# Altium project Task Tyler.PrjPcb (part 3 of 3)

## Sheet SOUND_SEC.SchDoc
size A4; SheetNumber: 7; SheetTotal: 30
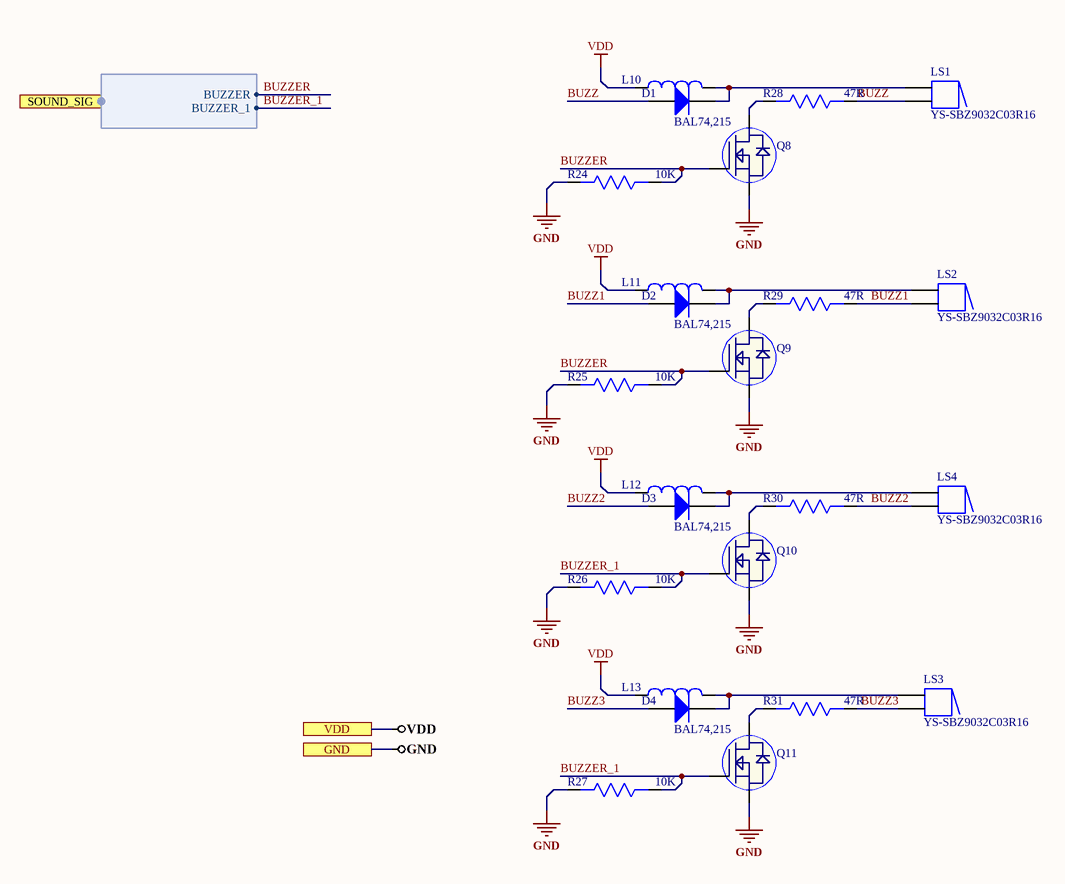
[diagram p29: SOUND_SEC.SchDoc]

### Parts
D1  BAL74,215  [SOT23-3]
D2  BAL74,215  [SOT23-3]
D3  BAL74,215  [SOT23-3]
D4  BAL74,215  [SOT23-3]
L10  MMZ0603S601CT000  [IND 0201]  (value not drawn)
L11  MMZ0603S601CT000  [IND 0201]  (value not drawn)
L12  MMZ0603S601CT000  [IND 0201]  (value not drawn)
L13  MMZ0603S601CT000  [IND 0201]  (value not drawn)
LS1  YS-SBZ9032C03R16  [YS-SBZ9032C03R16]
LS2  YS-SBZ9032C03R16  [YS-SBZ9032C03R16]
LS3  YS-SBZ9032C03R16  [YS-SBZ9032C03R16]
LS4  YS-SBZ9032C03R16  [YS-SBZ9032C03R16]
Q8  BSS138LT1G  [SOT23-3]  (value not drawn)
Q9  BSS138LT1G  [SOT23-3]  (value not drawn)
Q10  BSS138LT1G  [SOT23-3]  (value not drawn)
Q11  BSS138LT1G  [SOT23-3]  (value not drawn)
R24  10K  [Res-0201]
R25  10K  [Res-0201]
R26  10K  [Res-0201]
R27  10K  [Res-0201]
R28  47R  [Res-0201]
R29  47R  [Res-0201]
R30  47R  [Res-0201]
R31  47R  [Res-0201]

### Ports
GND, SOUND_SIG (harness Harness_4), VDD

### Harnesses
Harness_4: BUZZER, BUZZER_1

### Nets
GND: Q8.2(S) Q9.2(S) Q10.2(S) Q11.2(S) R24.2 R25.2 R26.2 R27.2 ; port GND
VDD: L10.1 L11.1 L12.1 L13.1 ; port VDD
BUZZ: D1.2(A) LS1.2 R28.1
BUZZ1: D2.2(A) LS2.2 R29.1
BUZZ2: D3.2(A) LS4.2 R30.1
BUZZ3: D4.2(A) LS3.2 R31.1
BUZZER: Q8.1(G) Q9.1(G) R24.1 R25.1 ; port SOUND_SIG.BUZZER
BUZZER_1: Q10.1(G) Q11.1(G) R26.1 R27.1 ; port SOUND_SIG.BUZZER_1
NetD1_1: D1.1(K) L10.2 LS1.1
NetD2_1: D2.1(K) L11.2 LS2.1
NetD3_1: D3.1(K) L12.2 LS4.1
NetD4_1: D4.1(K) L13.2 LS3.1
NetQ8_3: Q8.3(D) R28.2
NetQ9_3: Q9.3(D) R29.2
NetQ10_3: Q10.3(D) R30.2
NetQ11_3: Q11.3(D) R31.2

### Library data of the parts
D1-D4 = BAL74,215: DIODE GEN PURP 50V 215MA SOT23; Manufacturer: NXP Semiconductors; Manufacturer Part Number: BAL74215; Element Configuration: Single; Forward Current: 150mA; Max Reverse Current: 100nA; Reverse Recovery Time: 4ns; Peak Non-Repetitive Surge Current: 4A; Forward Voltage: 1.25V; Supplier 1: Newark; RoHS: Yes; Category: Rectifier Diodes; Mount: Surface Mount; Case/Package: TO-236-3; Number of Pins: 3; Contact Plating: Tin; Min Operating Temperature: -65°C; Max Operating Temperature: 150°C; Max Repetitive Reverse Voltage (Vrrm): 50V; Packaging: Tape and Reel; Max Surge Current: 4A; Recovery Time: 4ns; Package Quantity: 1; Max Reverse Leakage Current: 100nA; Average Rectified Current: 215mA; Max Forward Surge Current (Ifsm): 4A; Termination: SMD/SMT; Max Reverse Voltage (DC): 50V; Radiation Hardening: No; REACH SVHC: No SVHC; Lead Free: Lead Free; ComponentLink1URL: https://datasheet.ciiva.com/8299/bal74-8299264.pdf?src-supplier=Avnet; ComponentLink1Description: https://datasheet.ciiva.com/8299/bal74-8299264.pdf?src-supplier=Avnet; ComponentLink2URL: https://datasheet.ciiva.com/1179/453930-1179601.pdf?src-supplier=Element14; ComponentLink2Description: https://datasheet.ciiva.com/1179/453930-1179601.pdf?src-supplier=Element14; ComponentLink3URL: https://datasheet.ciiva.com/4434/bal74-109975-4434835.pdf?src-supplier=Mouser; ComponentLink3Description: https://datasheet.ciiva.com/4434/bal74-109975-4434835.pdf?src-supplier=Mouser; ComponentLink4URL: https://datasheet.ciiva.com/25953/bal74-25953738.pdf?src-supplier=Avnet+Europe; ComponentLink4Description: https://datasheet.ciiva.com/25953/bal74-25953738.pdf?src-supplier=Avnet+Europe; ComponentLink5URL: https://datasheet.ciiva.com/912/bal74-912156.pdf?src-supplier=Digi-Key; ComponentLink5Description: https://datasheet.ciiva.com/912/bal74-912156.pdf?src-supplier=Digi-Key; ComponentLink6URL: https://datasheet.ciiva.com/1202/453930-1202220.pdf?src-supplier=Farnell; ComponentLink6Description: https://datasheet.ciiva.com/1202/453930-1202220.pdf?src-supplier=Farnell; ComponentLink7URL: https://datasheet.ciiva.com/912/bal74-912157.pdf?src-supplier=Digi-Key; ComponentLink7Description: https://datasheet.ciiva.com/912/bal74-912157.pdf?src-supplier=Digi-Key; ComponentLink8URL: https://datasheet.ciiva.com/1202/453930-1202221.pdf?src-supplier=Farnell; ComponentLink8Description: https://datasheet.ciiva.com/1202/453930-1202221.pdf?src-supplier=Farnell; ComponentLink9URL: https://datasheet.ciiva.com/912/bal74-912158.pdf?src-supplier=Digi-Key; ComponentLink9Description: https://datasheet.ciiva.com/912/bal74-912158.pdf?src-supplier=Digi-Key; Supplier Part Number 1: 75R4923
L10-L13 = MMZ0603S601CT000: FERRITE BEAD 600 OHM 0201 1LN; Manufacturer: TDK; Impedance: 600R; Tolerance: 25%; DC Resistance (DCR): 1.45R; Max DC Current: 100mA; Supplier 1: Digi-Key; Manufacturer Part Number: MMZ0603S601CT000; RoHS: Yes; Category: Inductors; Stock 1: 1540; Pricing 1: 1=0.12000, 10=0.09900, 25=0.07680, 50=0.06380, 100=0.05500, 250=0.04400, 500=0.03960, 1000=0.03300, 5000=0.03080 (USD); Mount: Surface Mount; Case/Package: 0201; Core Material: Ferrite; Case Code (Metric): 0603; Case Code (Imperial): 0201; Packaging: Cut Tape; Package Quantity: 15000; Current Rating: 100mA; Length: 0.024inch; Width: 0.012inch; Height: 0.013inch; REACH SVHC: No SVHC; Lead Free: Lead Free; RoHS Compliant: Yes; ComponentLink1URL: https://datasheet.ciiva.com/46381/1795294-46381669.pdf?src-supplier=Element14; ComponentLink1Description: https://datasheet.ciiva.com/46381/1795294-46381669.pdf?src-supplier=Element14; ComponentLink2URL: https://datasheet.ciiva.com/46634/beads-commercial-signal-mmz-en-46634390.pdf?src-supplier=Digi-Key; ComponentLink2Description: https://datasheet.ciiva.com/46634/beads-commercial-signal-mmz-en-46634390.pdf?src-supplier=Digi-Key; ComponentLink3URL: https://datasheet.ciiva.com/48682/beads-commercial-signal-mmz-en-48682603.pdf?src-supplier=Avnet; ComponentLink3Description: https://datasheet.ciiva.com/48682/beads-commercial-signal-mmz-en-48682603.pdf?src-supplier=Avnet; ComponentLink4URL: https://datasheet.ciiva.com/46634/beads-commercial-signal-mmz-en-46634381.pdf?src-supplier=Digi-Key; ComponentLink4Description: https://datasheet.ciiva.com/46634/beads-commercial-signal-mmz-en-46634381.pdf?src-supplier=Digi-Key; Supplier Part Number 1: 445-2146-1-ND
LS1-LS4 = YS-SBZ9032C03R16: NO 2700Hz 85dB @ 3V, 10cm 3V Φ9mm SMD,9x3.2mm Buzzers RoHS; Manufacturer: Fengming; Operating Voltage: 2 ~ 4V; Package: SMD,9x3.2mm; Frequency - Self Resonant: 2700Hz; Rated Voltage: 3V
Q8-Q11 = BSS138LT1G: MOSFET N-CH 50V 200MA SOT-23; Manufacturer: ON Semiconductor; Gate to Source Voltage (Vgs): 20V; Nominal Vgs: 1.5V; Rds On Max: 3.5R; Input Capacitance: 50pF; Number of Elements: 1; Max Power Dissipation: 225mW; Turn-Off Delay Time: 20ns; Element Configuration: Single; ComponentLink1URL: https://datasheet.ciiva.com/22641/1596366-22641636.pdf; ComponentLink1Description: https://datasheet.ciiva.com/22641/1596366-22641636.pdf; ComponentLink2URL: https://datasheet.ciiva.com/1190/1596366-1190137.pdf; ComponentLink2Description: https://datasheet.ciiva.com/1190/1596366-1190137.pdf; ComponentLink3URL: https://datasheet.ciiva.com/15198/getdatasheetpartid-110266-15198908.pdf; ComponentLink3Description: https://datasheet.ciiva.com/15198/getdatasheetpartid-110266-15198908.pdf; ComponentLink4URL: https://datasheet.ciiva.com/8115/bss138lt1-d-8115295.pdf; ComponentLink4Description: https://datasheet.ciiva.com/8115/bss138lt1-d-8115295.pdf; ComponentLink5URL: https://datasheet.ciiva.com/8115/bss138lt1-d-8115358.pdf; ComponentLink5Description: https://datasheet.ciiva.com/8115/bss138lt1-d-8115358.pdf; ComponentLink6URL: https://datasheet.ciiva.com/1190/1596366-1190136.pdf; ComponentLink6Description: https://datasheet.ciiva.com/1190/1596366-1190136.pdf; ComponentLink7URL: https://datasheet.ciiva.com/936/bss138lt1-d-936802.pdf; ComponentLink7Description: https://datasheet.ciiva.com/936/bss138lt1-d-936802.pdf; ComponentLink8URL: https://datasheet.ciiva.com/936/bss138lt1-d-936801.pdf; ComponentLink8Description: https://datasheet.ciiva.com/936/bss138lt1-d-936801.pdf; ComponentLink9URL: https://datasheet.ciiva.com/14553/70099493-14553829.pdf; ComponentLink9Description: https://datasheet.ciiva.com/14553/70099493-14553829.pdf; ComponentLink10URL: https://datasheet.ciiva.com/936/bss138lt1-d-936803.pdf; ComponentLink10Description: https://datasheet.ciiva.com/936/bss138lt1-d-936803.pdf; Supplier 1: Digi-Key; Manufacturer Part Number: BSS138LT1G; Stock 1: 1283212; Pricing 1: 1=0.27, 10=0.222, 100=0.1177, 500=0.07746, 1000=0.05267 (USD); Case/Package: SOT-23-3; Number of Pins: 3; Contact Plating: Tin,Matte; Min Operating Temperature: -55°C; Max Operating Temperature: 150°C; Continuous Drain Current (ID): 200mA; Package Quantity: 1; Packaging: Tape and Reel; Drain to Source Breakdown Voltage: 50V; Power Dissipation: 225mW; Drain to Source Resistance: 3.5R; Threshold Voltage: 1.5V; Turn-On Delay Time: 20ns; Voltage Rating (DC): 50V; Current Rating: 200mA; On-State Resistance: 3.5R; Length: 3.04mm; Height: 1.01mm; Width: 1.4mm; Radiation Hardening: No; REACH SVHC: No SVHC; Lead Free: Lead Free; Halogen Free: Halogen Free; ComponentLink11URL: http://www.onsemi.com/pub/Collateral/BSS138LT1-D.PDF?src-supplier=Digi-Key; ComponentLink11Description: http://www.onsemi.com/pub/Collateral/BSS138LT1-D.PDF?src-supplier=Digi-Key; ComponentLink12URL: http://www.farnell.com/datasheets/1596366.pdf?src-supplier=Element14; ComponentLink12Description: http://www.farnell.com/datasheets/1596366.pdf?src-supplier=Element14; ComponentLink13URL: http://www.alliedelec.com/m/d/b3c6fd7d92596813fe75d33dcbaaae90.pdf?src-supplier=Allied+Electronics; ComponentLink13Description: http://www.alliedelec.com/m/d/b3c6fd7d92596813fe75d33dcbaaae90.pdf?src-supplier=Allied+Electronics; ComponentLink14URL: https://www.verical.com/server-webapp/html/getDatasheet?partID=110266&src-supplier=Verical; ComponentLink14Description: https://www.verical.com/server-webapp/html/getDatasheet?partID=110266&src-supplier=Verical; ComponentLink15URL: http://www.onsemi.com/pub_link/Collateral/BSS138LT1-D.PDF?src-supplier=Avnet; ComponentLink15Description: http://www.onsemi.com/pub_link/Collateral/BSS138LT1-D.PDF?src-supplier=Avnet; Supplier Part Number 1: BSS138LT1GOSDKR-ND
R24-R27 = RC0201FR-0710KL: RES SMD 10K OHM 1% 1/20W 0201; Manufacturer: Yageo; Temperature Coefficient: 200ppm/°C; Resistance: 10kR; Max Power Dissipation: 50mW; Working Voltage: 25V; Supplier 1: Digi-Key; Manufacturer Part Number: RC0201FR-0710KL; RoHS: Yes; Category: Chip SMD Resistors; Stock 1: 6892350; Pricing 1: 1=0.10000, 10=0.03600, 100=0.01480, 1000=0.00665, 2500=0.00577, 5000=0.00477 (USD); Case/Package: 0201; Number of Pins: 2; Contact Plating: Tin,Matte; Weight: 6E-06oz; Case Code (Imperial): 0201; Case Code (Metric): 0603; Min Operating Temperature: -55°C; Max Operating Temperature: 125°C; Resistor Type: Thick Film; Tolerance: 1%; Features: Moisture Resistant; Termination: SMD/SMT; Number of Terminations: 2; Power Rating: 50mW; Voltage Rating: 25V; Packaging: Tape and Reel; Package Quantity: 1; Voltage Rating (DC): 25V; Length: 0.6mm; Width: 0.3mm; Height: 0.01inch; Depth: 0.3mm; Radiation Hardening: No; REACH SVHC: No SVHC; Military Standard: Not; Lead Free: Lead Free; ComponentLink1URL: https://datasheet.ciiva.com/2467/pyu-r-int-thick-7-2467109.pdf?src-supplier=Digi-Key; ComponentLink1Description: https://datasheet.ciiva.com/2467/pyu-r-int-thick-7-2467109.pdf?src-supplier=Digi-Key; ComponentLink2URL: https://datasheet.ciiva.com/2467/pyu-r-int-thick-7-2467110.pdf?src-supplier=Digi-Key; ComponentLink2Description: https://datasheet.ciiva.com/2467/pyu-r-int-thick-7-2467110.pdf?src-supplier=Digi-Key; ComponentLink3URL: https://datasheet.ciiva.com/2467/pyu-r-int-thick-7-2467111.pdf?src-supplier=Digi-Key; ComponentLink3Description: https://datasheet.ciiva.com/2467/pyu-r-int-thick-7-2467111.pdf?src-supplier=Digi-Key; ComponentLink4URL: https://datasheet.ciiva.com/7660/1421516-7660807.pdf?src-supplier=Element14; ComponentLink4Description: https://datasheet.ciiva.com/7660/1421516-7660807.pdf?src-supplier=Element14; ComponentLink5URL: https://datasheet.ciiva.com/8891/pyu-rc0201-51-rohs-l-8-8891384.pdf?src-supplier=Avnet; ComponentLink5Description: https://datasheet.ciiva.com/8891/pyu-rc0201-51-rohs-l-8-8891384.pdf?src-supplier=Avnet; ComponentLink6URL: https://datasheet.ciiva.com/28405/pyu-rc0201-51-rohs-l-8-28405609.pdf?src-supplier=Avnet+Europe; ComponentLink6Description: https://datasheet.ciiva.com/28405/pyu-rc0201-51-rohs-l-8-28405609.pdf?src-supplier=Avnet+Europe; ComponentLink7URL: https://datasheet.ciiva.com/26829/getdatasheetpartid-421074-26829851.pdf?src-supplier=Verical; ComponentLink7Description: https://datasheet.ciiva.com/26829/getdatasheetpartid-421074-26829851.pdf?src-supplier=Verical; ComponentLink8URL: https://datasheet.ciiva.com/46391/1421516-46391339.pdf?src-supplier=Element14; ComponentLink8Description: https://datasheet.ciiva.com/46391/1421516-46391339.pdf?src-supplier=Element14; ComponentLink9URL: https://datasheet.ciiva.com/16855/pyu-rc0201-51-rohs-l-8-16855789.pdf?src-supplier=Avnet+Europe; ComponentLink9Description: https://datasheet.ciiva.com/16855/pyu-rc0201-51-rohs-l-8-16855789.pdf?src-supplier=Avnet+Europe; Supplier Part Number 1: 311-10.0KMCT-ND
R28-R31 = RK73H1HTTC47R0F: RES 47 OHM 1% 1/20W 0201; Manufacturer: KOA Speer; Power Rating: 50mW; Voltage Rating: 25V; Temperature Coefficient: 200ppm/°C; Supplier 1: Digi-Key; Manufacturer Part Number: RK73H1HTTC47R0F; RoHS: Yes; Category: Chip SMD Resistors; Stock 1: 7660; Pricing 1: 1=0.10000, 10=0.07500, 100=0.03050, 1000=0.01370, 2500=0.01189, 5000=0.00982 (USD); Case/Package: 0201; Case Code (Imperial): 0201; Case Code (Metric): 0603; Min Operating Temperature: -55°C; Max Operating Temperature: 125°C; Resistance: 47R; Tolerance: 1%; Packaging: Tape and Reel; Resistor Type: Thick Film; Termination: SMD/SMT; Voltage Rating (DC): 25V; Series: RK73H; Construction: Rectangular; Length: 0.6mm; Depth: 0.3mm; Military Standard: Not; RoHS Compliant: Yes; ComponentLink1URL: https://datasheet.ciiva.com/5552/rk73h-5552712.pdf?src-supplier=Mouser; ComponentLink1Description: https://datasheet.ciiva.com/5552/rk73h-5552712.pdf?src-supplier=Mouser; Supplier Part Number 1: 2019-RK73H1HTTC47R0FCT-ND

## Sheet LED_CONV_SIG.SchDoc
size A; SheetNumber: 4; SheetTotal: 30
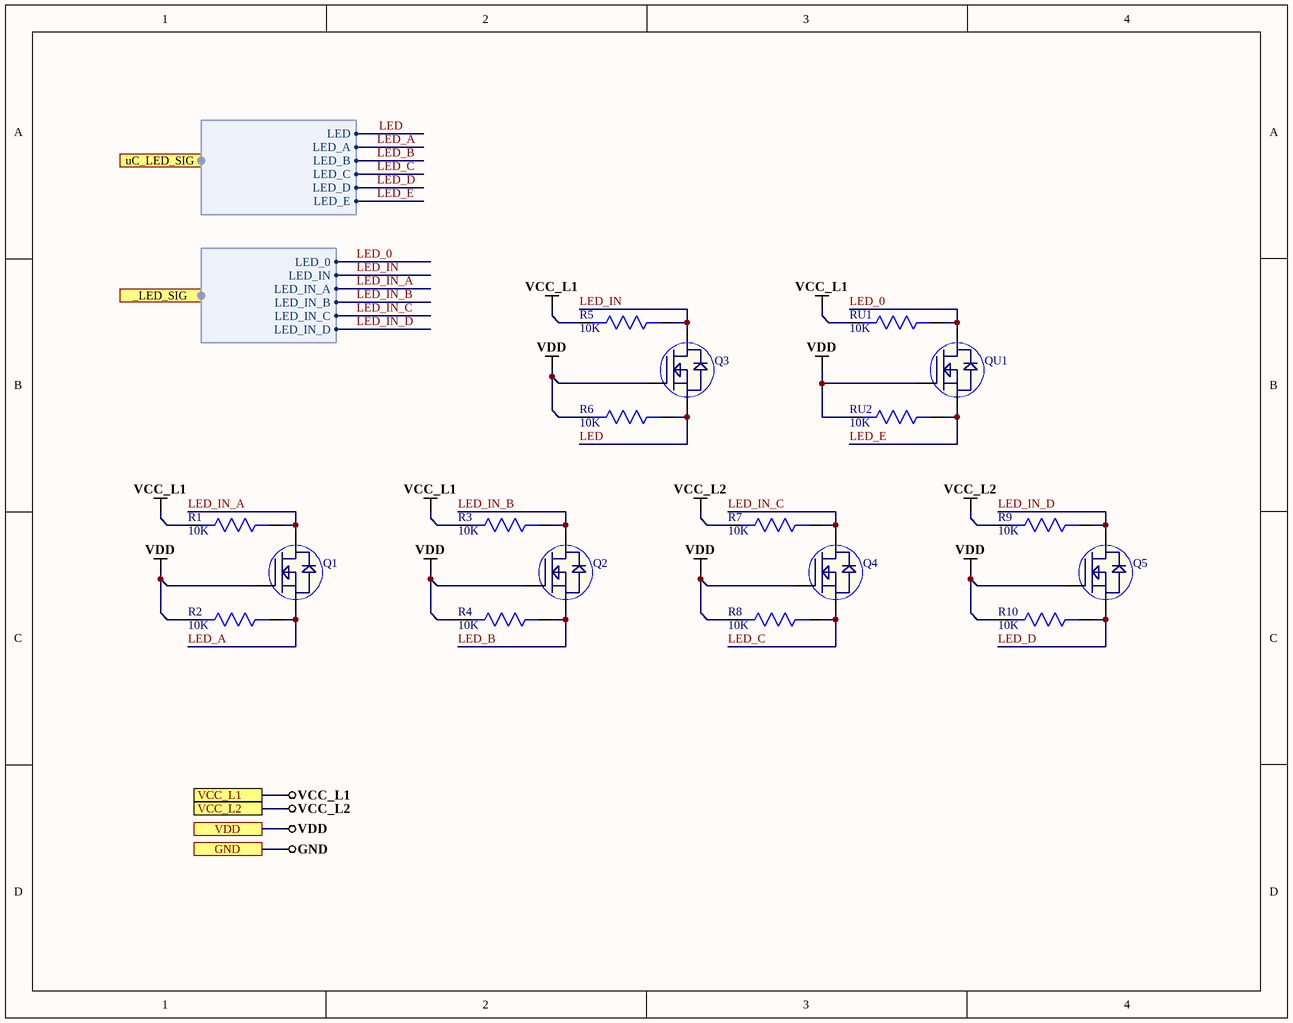
[diagram p30: LED_CONV_SIG.SchDoc]

### Parts
Q1  BSS138LT1G  [SOT23-3]  (value not drawn)
Q2  BSS138LT1G  [SOT23-3]  (value not drawn)
Q3  BSS138LT1G  [SOT23-3]  (value not drawn)
Q4  BSS138LT1G  [SOT23-3]  (value not drawn)
Q5  BSS138LT1G  [SOT23-3]  (value not drawn)
QU1  BSS138LT1G  [SOT23-3]  (value not drawn)
R1  10K  [Res-0201]
R2  10K  [Res-0201]
R3  10K  [Res-0201]
R4  10K  [Res-0201]
R5  10K  [Res-0201]
R6  10K  [Res-0201]
R7  10K  [Res-0201]
R8  10K  [Res-0201]
R9  10K  [Res-0201]
R10  10K  [Res-0201]
RU1  10K  [Res-0201]
RU2  10K  [Res-0201]

### Ports
_LED_SIG (harness Harness_8), GND, uC_LED_SIG (harness Harness_1), VCC_L1, VCC_L2, VDD

### Harnesses
Harness_1: LED_A, LED_B, LED_C, LED, LED_D, LED_E
Harness_8: LED_IN, LED_IN_A, LED_IN_B, LED_IN_C, LED_IN_D, LED_0

### Nets
VCC_L1: R1.1 R3.1 R5.1 RU1.1 ; port VCC_L1
VCC_L2: R7.1 R9.1 ; port VCC_L2
VDD: Q1.1(G) Q2.1(G) Q3.1(G) Q4.1(G) Q5.1(G) QU1.1(G) R2.1 R4.1 R6.1 R8.1 R10.1 RU2.1 ; port VDD
LED: Q3.2(S) R6.2 ; port uC_LED_SIG.LED
LED_0: QU1.3(D) RU1.2 ; port _LED_SIG.LED_0
LED_A: Q1.2(S) R2.2 ; port uC_LED_SIG.LED_A
LED_B: Q2.2(S) R4.2 ; port uC_LED_SIG.LED_B
LED_C: Q4.2(S) R8.2 ; port uC_LED_SIG.LED_C
LED_D: Q5.2(S) R10.2 ; port uC_LED_SIG.LED_D
LED_E: QU1.2(S) RU2.2 ; port uC_LED_SIG.LED_E
LED_IN: Q3.3(D) R5.2 ; port _LED_SIG.LED_IN
LED_IN_A: Q1.3(D) R1.2 ; port _LED_SIG.LED_IN_A
LED_IN_B: Q2.3(D) R3.2 ; port _LED_SIG.LED_IN_B
LED_IN_C: Q4.3(D) R7.2 ; port _LED_SIG.LED_IN_C
LED_IN_D: Q5.3(D) R9.2 ; port _LED_SIG.LED_IN_D

### Library data of the parts
Q1-Q5 QU1 = BSS138LT1G: as Q8 on sheet SOUND_SEC; ComponentLink1URL: https://datasheet.ciiva.com/22641/1596366-22641636.pdf; ComponentLink1Description: https://datasheet.ciiva.com/22641/1596366-22641636.pdf; ComponentLink2URL: https://datasheet.ciiva.com/1190/1596366-1190137.pdf; ComponentLink2Description: https://datasheet.ciiva.com/1190/1596366-1190137.pdf; ComponentLink3URL: https://datasheet.ciiva.com/15198/getdatasheetpartid-110266-15198908.pdf; ComponentLink3Description: https://datasheet.ciiva.com/15198/getdatasheetpartid-110266-15198908.pdf; ComponentLink4URL: https://datasheet.ciiva.com/8115/bss138lt1-d-8115295.pdf; ComponentLink4Description: https://datasheet.ciiva.com/8115/bss138lt1-d-8115295.pdf; ComponentLink5URL: https://datasheet.ciiva.com/8115/bss138lt1-d-8115358.pdf; ComponentLink5Description: https://datasheet.ciiva.com/8115/bss138lt1-d-8115358.pdf; ComponentLink6URL: https://datasheet.ciiva.com/1190/1596366-1190136.pdf; ComponentLink6Description: https://datasheet.ciiva.com/1190/1596366-1190136.pdf; ComponentLink7URL: https://datasheet.ciiva.com/936/bss138lt1-d-936802.pdf; ComponentLink7Description: https://datasheet.ciiva.com/936/bss138lt1-d-936802.pdf; ComponentLink8URL: https://datasheet.ciiva.com/936/bss138lt1-d-936801.pdf; ComponentLink8Description: https://datasheet.ciiva.com/936/bss138lt1-d-936801.pdf; ComponentLink9URL: https://datasheet.ciiva.com/14553/70099493-14553829.pdf; ComponentLink9Description: https://datasheet.ciiva.com/14553/70099493-14553829.pdf; ComponentLink10URL: https://datasheet.ciiva.com/936/bss138lt1-d-936803.pdf; ComponentLink10Description: https://datasheet.ciiva.com/936/bss138lt1-d-936803.pdf; Supplier 1: Digi-Key; Manufacturer Part Number: BSS138LT1G; Stock 1: 1283212; Pricing 1: 1=0.27, 10=0.222, 100=0.1177, 500=0.07746, 1000=0.05267 (USD); Case/Package: SOT-23-3; Number of Pins: 3; Contact Plating: Tin,Matte; Min Operating Temperature: -55°C; Max Operating Temperature: 150°C; Continuous Drain Current (ID): 200mA; Package Quantity: 1; Packaging: Tape and Reel; Drain to Source Breakdown Voltage: 50V; Power Dissipation: 225mW; Drain to Source Resistance: 3.5R; Threshold Voltage: 1.5V; Turn-On Delay Time: 20ns; Voltage Rating (DC): 50V; Current Rating: 200mA; On-State Resistance: 3.5R; Length: 3.04mm; Height: 1.01mm; Width: 1.4mm; Radiation Hardening: No; REACH SVHC: No SVHC; Lead Free: Lead Free; Halogen Free: Halogen Free; ComponentLink11URL: http://www.onsemi.com/pub/Collateral/BSS138LT1-D.PDF?src-supplier=Digi-Key; ComponentLink11Description: http://www.onsemi.com/pub/Collateral/BSS138LT1-D.PDF?src-supplier=Digi-Key; ComponentLink12URL: http://www.farnell.com/datasheets/1596366.pdf?src-supplier=Element14; ComponentLink12Description: http://www.farnell.com/datasheets/1596366.pdf?src-supplier=Element14; ComponentLink13URL: http://www.alliedelec.com/m/d/b3c6fd7d92596813fe75d33dcbaaae90.pdf?src-supplier=Allied+Electronics; ComponentLink13Description: http://www.alliedelec.com/m/d/b3c6fd7d92596813fe75d33dcbaaae90.pdf?src-supplier=Allied+Electronics; ComponentLink14URL: https://www.verical.com/server-webapp/html/getDatasheet?partID=110266&src-supplier=Verical; ComponentLink14Description: https://www.verical.com/server-webapp/html/getDatasheet?partID=110266&src-supplier=Verical; ComponentLink15URL: http://www.onsemi.com/pub_link/Collateral/BSS138LT1-D.PDF?src-supplier=Avnet; ComponentLink15Description: http://www.onsemi.com/pub_link/Collateral/BSS138LT1-D.PDF?src-supplier=Avnet; Supplier Part Number 1: BSS138LT1GOSDKR-ND
R1-R10 RU1 RU2 = RC0201FR-0710KL: GENERAL 0201 11% REEL (7INCH); Manufacturer: Yageo; Temperature Coefficient: 200ppm/°C; Resistance: 10kR; Tolerance: 1%; Max Power Dissipation: 50mW; Working Voltage: 25V; Supplier 1: Digi-Key; Manufacturer Part Number: RC0201FR-0710KL; RoHS: Yes; Category: Chip SMD Resistors; Stock 1: 6892350; Pricing 1: 1=0.10000, 10=0.03600, 100=0.01480, 1000=0.00665, 2500=0.00577, 5000=0.00477 (USD); Case/Package: 0201; Number of Pins: 2; Contact Plating: Tin,Matte; Weight: 6E-06oz; Case Code (Imperial): 0201; Case Code (Metric): 0603; Min Operating Temperature: -55°C; Max Operating Temperature: 125°C; Resistor Type: Thick Film; Features: Moisture Resistant; Termination: SMD/SMT; Number of Terminations: 2; Power Rating: 50mW; Voltage Rating: 25V; Packaging: Tape and Reel; Package Quantity: 1; Voltage Rating (DC): 25V; Length: 0.6mm; Width: 0.3mm; Height: 0.01inch; Depth: 0.3mm; Radiation Hardening: No; REACH SVHC: No SVHC; Military Standard: Not; Lead Free: Lead Free; ComponentLink1URL: https://datasheet.ciiva.com/2467/pyu-r-int-thick-7-2467109.pdf?src-supplier=Digi-Key; ComponentLink1Description: https://datasheet.ciiva.com/2467/pyu-r-int-thick-7-2467109.pdf?src-supplier=Digi-Key; ComponentLink2URL: https://datasheet.ciiva.com/2467/pyu-r-int-thick-7-2467110.pdf?src-supplier=Digi-Key; ComponentLink2Description: https://datasheet.ciiva.com/2467/pyu-r-int-thick-7-2467110.pdf?src-supplier=Digi-Key; ComponentLink3URL: https://datasheet.ciiva.com/2467/pyu-r-int-thick-7-2467111.pdf?src-supplier=Digi-Key; ComponentLink3Description: https://datasheet.ciiva.com/2467/pyu-r-int-thick-7-2467111.pdf?src-supplier=Digi-Key; ComponentLink4URL: https://datasheet.ciiva.com/7660/1421516-7660807.pdf?src-supplier=Element14; ComponentLink4Description: https://datasheet.ciiva.com/7660/1421516-7660807.pdf?src-supplier=Element14; ComponentLink5URL: https://datasheet.ciiva.com/8891/pyu-rc0201-51-rohs-l-8-8891384.pdf?src-supplier=Avnet; ComponentLink5Description: https://datasheet.ciiva.com/8891/pyu-rc0201-51-rohs-l-8-8891384.pdf?src-supplier=Avnet; ComponentLink6URL: https://datasheet.ciiva.com/28405/pyu-rc0201-51-rohs-l-8-28405609.pdf?src-supplier=Avnet+Europe; ComponentLink6Description: https://datasheet.ciiva.com/28405/pyu-rc0201-51-rohs-l-8-28405609.pdf?src-supplier=Avnet+Europe; ComponentLink7URL: https://datasheet.ciiva.com/26829/getdatasheetpartid-421074-26829851.pdf?src-supplier=Verical; ComponentLink7Description: https://datasheet.ciiva.com/26829/getdatasheetpartid-421074-26829851.pdf?src-supplier=Verical; ComponentLink8URL: https://datasheet.ciiva.com/46391/1421516-46391339.pdf?src-supplier=Element14; ComponentLink8Description: https://datasheet.ciiva.com/46391/1421516-46391339.pdf?src-supplier=Element14; ComponentLink9URL: https://datasheet.ciiva.com/16855/pyu-rc0201-51-rohs-l-8-16855789.pdf?src-supplier=Avnet+Europe; ComponentLink9Description: https://datasheet.ciiva.com/16855/pyu-rc0201-51-rohs-l-8-16855789.pdf?src-supplier=Avnet+Europe; Supplier Part Number 1: 311-10.0KMCT-ND

## Sheet RTC_SEC.SchDoc
size A; SheetNumber: 6; SheetTotal: 30
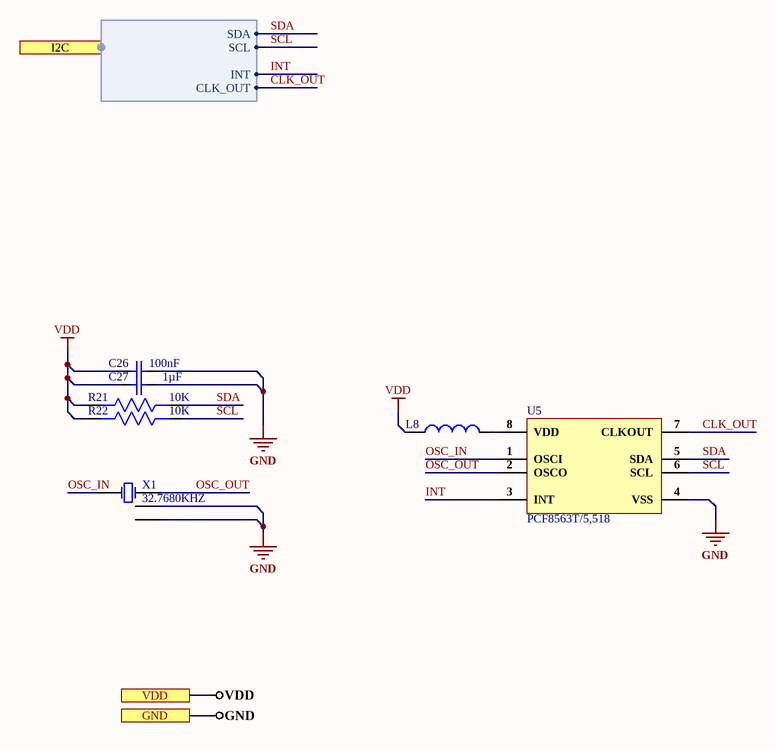
[diagram p31: RTC_SEC.SchDoc]

### Parts
C26  100nF  [Cap0402]
C27  1µF  [Cap0402]
L8  MMZ0603S601CT000  [IND 0201]  (value not drawn)
R21  10K  [Res-0201]
R22  10K  [Res-0201]
U5  PCF8563T/5,518  [8-SO]
X1  32.7680KHZ  [CM200C32768DZFT]

### Ports
GND, I2C (harness Harness_3), VDD

### Harnesses
Harness_3: SDA, SCL, INT, CLK_OUT

### Nets
GND: C26.1 C27.1 U5.4(VSS) X1.2(OSC3) X1.3(OSC4) ; port GND
VDD: C26.2 C27.2 L8.1 R21.2 R22.2 ; port VDD
CLK_OUT: U5.7(CLKOUT) ; port I2C.CLK_OUT
INT: U5.3(INT) ; port I2C.INT
OSC_IN: U5.1(OSCI) X1.1(OSC1)
OSC_OUT: U5.2(OSCO) X1.4(OSC2)
SCL: R22.1 U5.6(SCL) ; port I2C.SCL
SDA: R21.1 U5.5(SDA) ; port I2C.SDA
NetL8_2: L8.2 U5.8(VDD)

### Library data of the parts
C26 = CC0402KRX7R8BB104: CAP CER 0.1UF 25V X7R 0402; Manufacturer: Yageo; Tolerance: 10%; Dissipation Factor: 3.5%; Supplier 1: Digi-Key; Manufacturer Part Number: CC0402KRX7R8BB104; RoHS: Yes; Category: Ceramic Capacitors; Stock 1: 1841009; Pricing 1: 1=0.10000, 10=0.03100, 50=0.01700, 100=0.01390, 500=0.00990, 1000=0.00777, 2500=0.00707, 5000=0.00650 (USD); Mount: Surface Mount; Case/Package: 0402; Case Code (Imperial): 0402; Case Code (Metric): 1005; Min Operating Temperature: -55°C; Max Operating Temperature: 125°C; Capacitance: 100nF; Dielectric: X7R; Voltage Rating: 25V; Voltage Rating (DC): 25V; Packaging: Tape and Reel; Termination: SMD/SMT; Resistor Type: Ceramic; Length: 1mm; Width: 0.02inch; Height: 0.5mm; Thickness: 0.022inch; Depth: 0.5mm; Radiation Hardening: No; Lead Free: Lead Free; Halogen Free: Halogen Free; ComponentLink1URL: https://datasheet.ciiva.com/11464/upy-gphc-x7r-6-3v-to-50v-8-11464889.pdf?src-supplier=Avnet; ComponentLink1Description: https://datasheet.ciiva.com/11464/upy-gphc-x7r-6-3v-to-50v-8-11464889.pdf?src-supplier=Avnet; ComponentLink2URL: https://datasheet.ciiva.com/13210/upy-gphc-x7r-6-3v-to-50v-8-12304-13210908.pdf?src-supplier=Mouser; ComponentLink2Description: https://datasheet.ciiva.com/13210/upy-gphc-x7r-6-3v-to-50v-8-12304-13210908.pdf?src-supplier=Mouser; ComponentLink3URL: https://datasheet.ciiva.com/17437/upy-gphc-x7r-6-3v-to-50v-8-17437357.pdf?src-supplier=Avnet+Europe; ComponentLink3Description: https://datasheet.ciiva.com/17437/upy-gphc-x7r-6-3v-to-50v-8-17437357.pdf?src-supplier=Avnet+Europe; Supplier Part Number 1: 311-2077-1-ND
C27 = GRM155R61E105KA12D: CAP CER 1UF 25V X5R 0402; Manufacturer: Murata; Material: Ceramic; Tolerance: 10%; Supplier 1: Digi-Key; Manufacturer Part Number: GRM155R61E105KA12D; RoHS: Yes; Category: Ceramic Capacitors; Stock 1: 961231; Pricing 1: 1=0.11000, 10=0.08000, 50=0.04360, 100=0.03560, 500=0.02542, 1000=0.01997, 2500=0.01815, 5000=0.01670 (USD); Mount: Surface Mount; Case/Package: 0402; Case Code (Metric): 1005; Case Code (Imperial): 0402; Weight: 0.000212oz; Min Operating Temperature: -55°C; Max Operating Temperature: 85°C; Capacitance: 1uF; Voltage Rating: 25V; Packaging: Tape and Reel; Dielectric: X5R; Voltage: 25V; Termination: SMD/SMT; Voltage Rating (DC): 25V; Package Quantity: 10000; Series: GRM; Length: 1mm; Width: 0.5mm; Height: 0.5mm; Thickness: 0.022inch; Depth: 0.5mm; REACH SVHC: No SVHC; Lead Free: Lead Free; ComponentLink1URL: https://datasheet.ciiva.com/22732/1666664-22732122.pdf?src-supplier=Element14; ComponentLink1Description: https://datasheet.ciiva.com/22732/1666664-22732122.pdf?src-supplier=Element14; ComponentLink2URL: https://datasheet.ciiva.com/7719/1666664-7719006.pdf?src-supplier=Element14; ComponentLink2Description: https://datasheet.ciiva.com/7719/1666664-7719006.pdf?src-supplier=Element14; Supplier Part Number 1: 490-10017-1-ND
L8 = MMZ0603S601CT000: as L10 on sheet SOUND_SEC; Supplier 1: Digi-Key; Manufacturer Part Number: MMZ0603S601CT000; RoHS: Yes; Category: Inductors; Stock 1: 1540; Pricing 1: 1=0.12000, 10=0.09900, 25=0.07680, 50=0.06380, 100=0.05500, 250=0.04400, 500=0.03960, 1000=0.03300, 5000=0.03080 (USD); Mount: Surface Mount; Case/Package: 0201; Core Material: Ferrite; Case Code (Metric): 0603; Case Code (Imperial): 0201; Packaging: Cut Tape; Package Quantity: 15000; Current Rating: 100mA; Length: 0.024inch; Width: 0.012inch; Height: 0.013inch; REACH SVHC: No SVHC; Lead Free: Lead Free; RoHS Compliant: Yes; ComponentLink1URL: https://datasheet.ciiva.com/46381/1795294-46381669.pdf?src-supplier=Element14; ComponentLink1Description: https://datasheet.ciiva.com/46381/1795294-46381669.pdf?src-supplier=Element14; ComponentLink2URL: https://datasheet.ciiva.com/46634/beads-commercial-signal-mmz-en-46634390.pdf?src-supplier=Digi-Key; ComponentLink2Description: https://datasheet.ciiva.com/46634/beads-commercial-signal-mmz-en-46634390.pdf?src-supplier=Digi-Key; ComponentLink3URL: https://datasheet.ciiva.com/48682/beads-commercial-signal-mmz-en-48682603.pdf?src-supplier=Avnet; ComponentLink3Description: https://datasheet.ciiva.com/48682/beads-commercial-signal-mmz-en-48682603.pdf?src-supplier=Avnet; ComponentLink4URL: https://datasheet.ciiva.com/46634/beads-commercial-signal-mmz-en-46634381.pdf?src-supplier=Digi-Key; ComponentLink4Description: https://datasheet.ciiva.com/46634/beads-commercial-signal-mmz-en-46634381.pdf?src-supplier=Digi-Key; Supplier Part Number 1: 445-2146-1-ND
R21 R22 = RC0201FR-0710KL: as R24 on sheet SOUND_SEC; Supplier 1: Digi-Key; Manufacturer Part Number: RC0201FR-0710KL; RoHS: Yes; Category: Chip SMD Resistors; Stock 1: 6892350; Pricing 1: 1=0.10000, 10=0.03600, 100=0.01480, 1000=0.00665, 2500=0.00577, 5000=0.00477 (USD); Case/Package: 0201; Number of Pins: 2; Contact Plating: Tin,Matte; Weight: 6E-06oz; Case Code (Imperial): 0201; Case Code (Metric): 0603; Min Operating Temperature: -55°C; Max Operating Temperature: 125°C; Resistor Type: Thick Film; Tolerance: 1%; Features: Moisture Resistant; Termination: SMD/SMT; Number of Terminations: 2; Power Rating: 50mW; Voltage Rating: 25V; Packaging: Tape and Reel; Package Quantity: 1; Voltage Rating (DC): 25V; Length: 0.6mm; Width: 0.3mm; Height: 0.01inch; Depth: 0.3mm; Radiation Hardening: No; REACH SVHC: No SVHC; Military Standard: Not; Lead Free: Lead Free; ComponentLink1URL: https://datasheet.ciiva.com/2467/pyu-r-int-thick-7-2467109.pdf?src-supplier=Digi-Key; ComponentLink1Description: https://datasheet.ciiva.com/2467/pyu-r-int-thick-7-2467109.pdf?src-supplier=Digi-Key; ComponentLink2URL: https://datasheet.ciiva.com/2467/pyu-r-int-thick-7-2467110.pdf?src-supplier=Digi-Key; ComponentLink2Description: https://datasheet.ciiva.com/2467/pyu-r-int-thick-7-2467110.pdf?src-supplier=Digi-Key; ComponentLink3URL: https://datasheet.ciiva.com/2467/pyu-r-int-thick-7-2467111.pdf?src-supplier=Digi-Key; ComponentLink3Description: https://datasheet.ciiva.com/2467/pyu-r-int-thick-7-2467111.pdf?src-supplier=Digi-Key; ComponentLink4URL: https://datasheet.ciiva.com/7660/1421516-7660807.pdf?src-supplier=Element14; ComponentLink4Description: https://datasheet.ciiva.com/7660/1421516-7660807.pdf?src-supplier=Element14; ComponentLink5URL: https://datasheet.ciiva.com/8891/pyu-rc0201-51-rohs-l-8-8891384.pdf?src-supplier=Avnet; ComponentLink5Description: https://datasheet.ciiva.com/8891/pyu-rc0201-51-rohs-l-8-8891384.pdf?src-supplier=Avnet; ComponentLink6URL: https://datasheet.ciiva.com/28405/pyu-rc0201-51-rohs-l-8-28405609.pdf?src-supplier=Avnet+Europe; ComponentLink6Description: https://datasheet.ciiva.com/28405/pyu-rc0201-51-rohs-l-8-28405609.pdf?src-supplier=Avnet+Europe; ComponentLink7URL: https://datasheet.ciiva.com/26829/getdatasheetpartid-421074-26829851.pdf?src-supplier=Verical; ComponentLink7Description: https://datasheet.ciiva.com/26829/getdatasheetpartid-421074-26829851.pdf?src-supplier=Verical; ComponentLink8URL: https://datasheet.ciiva.com/46391/1421516-46391339.pdf?src-supplier=Element14; ComponentLink8Description: https://datasheet.ciiva.com/46391/1421516-46391339.pdf?src-supplier=Element14; ComponentLink9URL: https://datasheet.ciiva.com/16855/pyu-rc0201-51-rohs-l-8-16855789.pdf?src-supplier=Avnet+Europe; ComponentLink9Description: https://datasheet.ciiva.com/16855/pyu-rc0201-51-rohs-l-8-16855789.pdf?src-supplier=Avnet+Europe; Supplier Part Number 1: 311-10.0KMCT-ND
U5 = PCF8563T/5,518: IC RTC CLK/CALENDAR I2C 8-SOIC
X1 = CM200C32768DZFT: CRYSTAL 32.7680KHZ 12.5PF SMD; Manufacturer: Citizen; ESR (Equivalent Series Resistance): 50kR; Frequency Tolerance: 20ppm; Frequency: 32.768kHz; Supplier 1: Mouser; Manufacturer Part Number: CM200C32768DZFT; RoHS: Yes; Category: Crystals; Stock 1: 1; Pricing 1: 1=0.57000, 10=0.47500, 50=0.42700, 100=0.38000, 1000=0.30400, 10000=0.25400 (USD); Mount: Surface Mount; Case/Package: SMD/SMT; Min Operating Temperature: -40°C; Max Operating Temperature: 85°C; Load Capacitance: 12.5pF; Packaging: Tape and Reel; Package Quantity: 3000; Lead Free: Lead Free; REACH SVHC: Unknown; ComponentLink1URL: https://datasheet.ciiva.com/13163/cm200c-citizen-187069-13163866.pdf?src-supplier=Mouser; ComponentLink1Description: https://datasheet.ciiva.com/13163/cm200c-citizen-187069-13163866.pdf?src-supplier=Mouser; ComponentLink2URL: https://datasheet.ciiva.com/16437/cm200c-250c-16437102.pdf?src-supplier=Future+Electronics; ComponentLink2Description: https://datasheet.ciiva.com/16437/cm200c-250c-16437102.pdf?src-supplier=Future+Electronics; ComponentLink3URL: https://datasheet.ciiva.com/48778/1673496-48778901.pdf?src-supplier=Element14; ComponentLink3Description: https://datasheet.ciiva.com/48778/1673496-48778901.pdf?src-supplier=Element14; Supplier Part Number 1: 695-CM200C-32768DZFT

## Sheet Connector Section.SchDoc
size A; DocumentNumber: 5; SheetNumber: 2; SheetTotal: 30
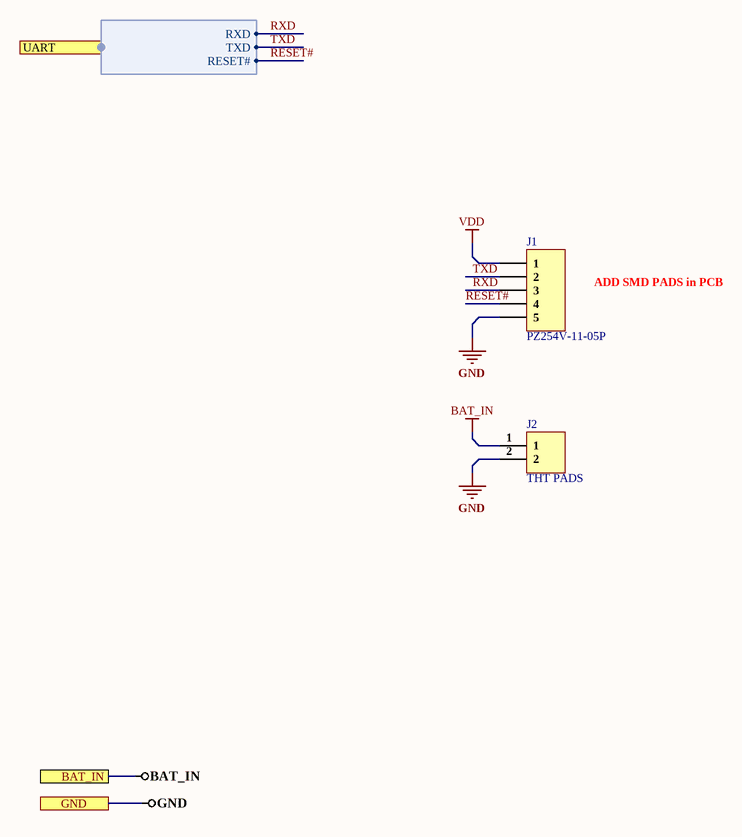
[diagram p32: Connector Section.SchDoc]

### Parts
J1  PZ254V-11-05P  [PZ254V-11-05P]
J2  THT PADS  [THT PAD]

### Ports
BAT_IN, GND, UART (harness Harness)

### Harnesses
Harness: RXD, TXD, RESET#

### Nets
BAT_IN: J2.1 ; port BAT_IN
GND: J1.5 J2.2 ; port GND
VDD: J1.1
RESET#: J1.4 ; port UART.RESET#
RXD: J1.3 ; port UART.RXD
TXD: J1.2 ; port UART.TXD

### Notes on the sheet
- ADD SMD PADS in PCB

### Library data of the parts
J1 = PZ254V-11-05P: Pin Header 5 1 right-angle; Manufacturer: XFCN; Brand Category: Made In Asia Brands; Pitch: 2.54; Packaging: Bag-packed; Connector Type: Pin Header; Number of Pins: 5; Number of Rows: 1
J2 = THT PAD

## Nets that join several sheets
BAT_IN: Power Section (P3.1), POWER_SWITCH (C25.2 SB17.1 SB18.1 SW2.1), Connector Section (J2.1)
GND: Ring 1 (13 pins), Ring 2_A (10 pins), Ring 2_B (12 pins), Ring 3_B (11 pins), Ring 3_A (12 pins), Ring 3_C (9 pins), Ring 4_A (16 pins), Ring 4_B (13 pins), Ring 4_C (13 pins), Ring 5_A (14 pins), Ring 5_B (14 pins), Ring 5_C (12 pins), Ring 5_D (12 pins), Decoup_Cap 1 (81 pins), Decoup_Cap 2 (80 pins), Power Section (P7.1), MCU_POWER (C12.1 C13.1 U4.5 U4.9), LED_POWER (12 pins), POWER_SWITCH (12 pins), SEC_POWER (C28.1 C29.1 U6.1 U6.7), LED_POWER 2 (6 pins), MAIN_CONN (7 pins), SOUND_SEC (8 pins), RTC_SEC (5 pins), Connector Section (J1.5 J2.2)
V_BAT: Power Section (P4.1), POWER_SWITCH (8 pins)
V_C1: POWER_SWITCH (SB15.2), LED_POWER 2 (D5.2 R33.2)
V_C2: POWER_SWITCH (SB16.2), LED_POWER 2 (D5a.2 R34a.2)
V_LED_2: LED_POWER (L1.2 U1.9 U1.10), POWER_SWITCH (C20.1 C21.1 C22.1 L7.2)
V_MCU: MCU_POWER (R20.2 U4.7 U4.8), POWER_SWITCH (C23.1 C24.1 L4.2)
V_O1: POWER_SWITCH (L6.1), LED_POWER 2 (C191.2 D5.3 R34.2)
V_O2: POWER_SWITCH (L7.1), LED_POWER 2 (C192a.2 D5a.3 R35a.2)
V_TR: POWER_SWITCH (C14.1 C15.1 C16.1 L5.2), SEC_POWER (L9.1 R23.2 U6.6)
VCC: Power Section (P6.1), POWER_SWITCH (SB19.2), SEC_POWER (SB20.2)
VCC_L1: Ring 1 (13 pins), Ring 2_A (10 pins), Ring 2_B (12 pins), Ring 3_B (11 pins), Ring 3_A (12 pins), Ring 3_C (9 pins), Ring 4_A (14 pins), Decoup_Cap 1 (81 pins), Power Section (P1.1), LED_POWER (SB6.2), LED_CONV_SIG (R1.1 R3.1 R5.1 RU1.1)
VCC_L2: Ring 4_A (LED81.1 LED82.1), Ring 4_B (13 pins), Ring 4_C (13 pins), Ring 5_A (14 pins), Ring 5_B (14 pins), Ring 5_C (12 pins), Ring 5_D (12 pins), Decoup_Cap 2 (80 pins), Power Section (P2.1), LED_POWER (SB5.2), LED_CONV_SIG (R7.1 R9.1)
VDD: Power Section (P5.1), MCU_POWER (5 pins), MAIN_CONN (C9.2 C10.2 L3.1), SOUND_SEC (L10.1 L11.1 L12.1 L13.1), LED_CONV_SIG (12 pins), RTC_SEC (5 pins), Connector Section (J1.1)
VIN: LED_POWER (L2.2 U2.9 U2.10), POWER_SWITCH (C17.1 C18.1 C19.1 L6.2)
BUZZER: MAIN_CONN (U3.6), SOUND_SEC (Q8.1 Q9.1 R24.1 R25.1)
BUZZER_1: MAIN_CONN (U3.7), SOUND_SEC (Q10.1 Q11.1 R26.1 R27.1)
CLK_OUT: MAIN_CONN (P8.1 SB8.2), RTC_SEC (U5.7)
DOUT12: Ring 1 (LED12.2), Ring 2_A (LED13.4)
DOUT22: Ring 2_A (LED22.2), Ring 2_B (LED23.4)
DOUT34: Ring 2_B (LED34.2), Ring 3_A (LED35.4)
DOUT46: Ring 3_B (LED47.4), Ring 3_A (LED46.2)
DOUT57: Ring 3_B (LED57.2), Ring 3_C (LED58.4)
DOUT66: Ring 3_C (LED66.2), Ring 4_A (LED67.4)
DOUT82: Ring 4_A (LED82.2), Ring 4_B (LED83.4)
DOUT95: Ring 4_B (LED95.2), Ring 4_C (LED96.4)
DOUT108: Ring 4_C (LED108.2), Ring 5_A (LED109.4)
DOUT122: Ring 5_A (LED122.2), Ring 5_B (LED123.4)
DOUT136: Ring 5_B (LED136.2), Ring 5_C (LED137.4)
DOUT148: Ring 5_C (LED148.2), Ring 5_D (LED149.4)
EN_CO_1: LED_POWER 2 (R32.2), MAIN_CONN (U3.9)
EN_CO_2: LED_POWER 2 (R33a.2), MAIN_CONN (U3.10)
INT: MAIN_CONN (U3.5), RTC_SEC (U5.3)
LED: MAIN_CONN (SB7.1), LED_CONV_SIG (Q3.2 R6.2)
LED_0: Ring 1 (LED0.4), LED_CONV_SIG (QU1.3 RU1.2)
LED_A: MAIN_CONN (SB9.2), LED_CONV_SIG (Q1.2 R2.2)
LED_B: MAIN_CONN (SB10.2), LED_CONV_SIG (Q2.2 R4.2)
LED_C: MAIN_CONN (SB11.2), LED_CONV_SIG (Q4.2 R8.2)
LED_D: MAIN_CONN (SB12.2), LED_CONV_SIG (Q5.2 R10.2)
LED_E: MAIN_CONN (U3.1), LED_CONV_SIG (QU1.2 RU2.2)
LED_IN: Ring 1 (SB1.1), LED_CONV_SIG (Q3.3 R5.2)
LED_IN_A: Ring 1 (SB2.1), LED_CONV_SIG (Q1.3 R1.2)
LED_IN_B: Ring 3_A (SB4.1), LED_CONV_SIG (Q2.3 R3.2)
LED_IN_C: Ring 4_A (SB_L2.1), LED_CONV_SIG (Q4.3 R7.2)
LED_IN_D: Ring 5_A (SB_L4.1), LED_CONV_SIG (Q5.3 R9.2)
RESET#: MAIN_CONN (R19.2), Connector Section (J1.4)
RXD: MAIN_CONN (U3.11), Connector Section (J1.3)
SCL: MAIN_CONN (U3.14), RTC_SEC (R22.1 U5.6)
SDA: MAIN_CONN (U3.13), RTC_SEC (R21.1 U5.5)
TXD: MAIN_CONN (U3.12), Connector Section (J1.2)